# Altium schematic sheet current_sensor.SchDoc
size A
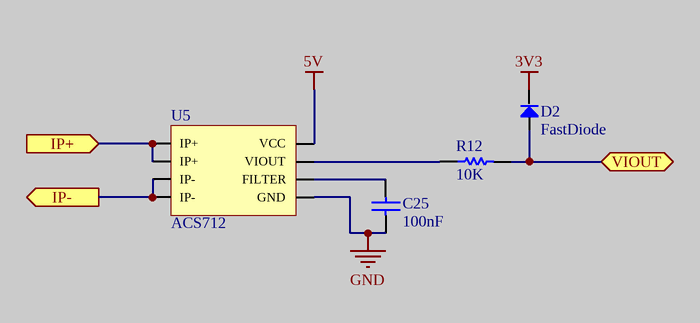
[diagram p0: current_sensor.SchDoc]

## Parts
C25  100nF  [CAPC0603]
D2  FastDiode  [FastDiode]
R12  10K  [RESC0603]
U5  ACS712  [ACS712]

## Ports
IP+ (in), IP- (out), VIOUT (bidir)

## Nets
3V3: D2.2(K)
5V: U5.8(VCC)
GND: C25.1 U5.5(GND)
IP+: U5.1(IP+) U5.2(IP+) ; port IP+
IP-: U5.3(IP-) U5.4(IP-) ; port IP-
VIOUT: D2.1(A) R12.2 ; port VIOUT
NetC25_2: C25.2 U5.6(FILTER)
NetR12_1: R12.1 U5.7(VIOUT)

## Library data of the parts
C25 = Capacitor: Published: 8-Jun-2000; LatestRevisionDate: 17-Jul-2002; LatestRevisionNote: Re-released for DXP Platform.; PackageReference: C0805; Publisher: Altium Limited; Value: 100nF
R12 = Resistor: 0603,0.1W; Published: 8-Jun-2000; LatestRevisionDate: 17-Jul-2002; LatestRevisionNote: Re-released for DXP Platform.; PackageReference: AXIAL-0.5; Publisher: Altium Limited; Value: 10K
U5 = ACS712: Sensing Current
D2 = FastDiode: Published: 8-Jun-2000; LatestRevisionDate: 17-Dec-2003; LatestRevisionNote: PCB Footprint replaced.; DatasheetDocument: 16-Apr-2002; PackageDocument: 16-Apr-2002; PackageReference: 3.5X2.8X1.9; Publisher: Altium Limited